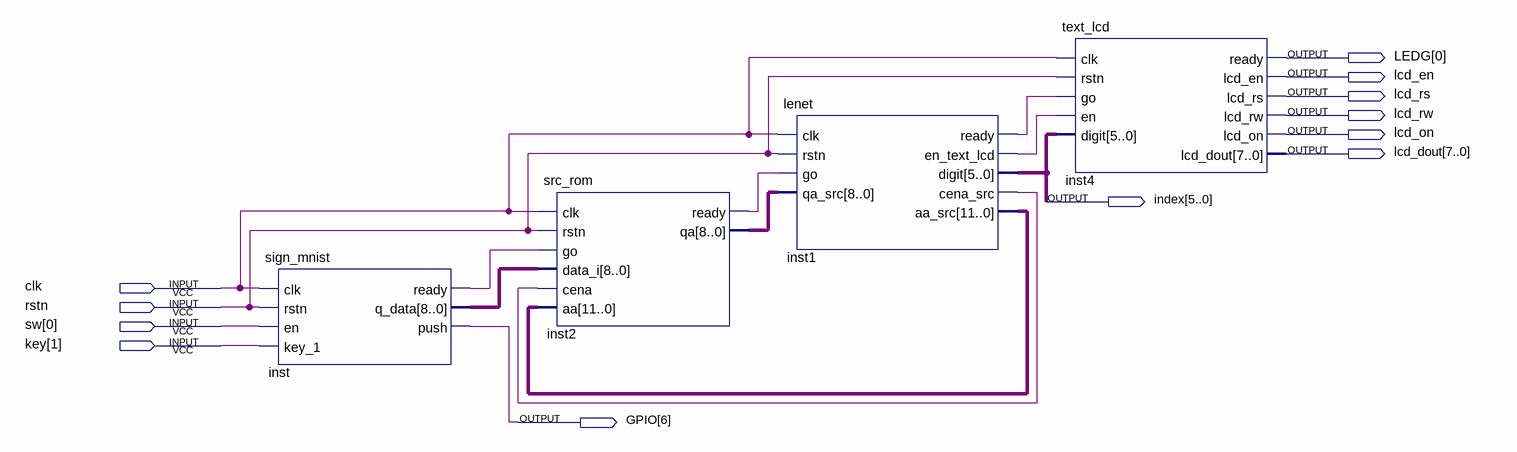
[diagram p0: schematic sheet]
// Quartus schematic sign_F_block.bdf as structural Verilog: 4 symbols, 12 pins
module sign_F_block (
  input  clk,
  input  rstn,
  input  [0:0] sw,
  input  [1:1] key,
  output [0:0] LEDG,
  output lcd_en,
  output lcd_rs,
  output lcd_rw,
  output lcd_on,
  output [7:0] lcd_dout,
  output [5:0] index,
  output [6:6] GPIO
);

  wire inst1_cena_src, inst1_en_text_lcd, inst1_ready, inst2_ready, inst_ready;
  wire [8:0] inst2_qa, inst_q_data;
  wire [11:0] inst1_aa_src;

  sign_mnist inst (
    .clk(clk), .rstn(rstn), .en(sw[0]), .key_1(key[1]), .ready(inst_ready), .q_data(inst_q_data),
    .push(GPIO[6]));
  src_rom inst2 (
    .clk(clk), .rstn(rstn), .go(inst_ready), .data_i(inst_q_data), .cena(inst1_cena_src), .aa(inst1_aa_src),
    .ready(inst2_ready), .qa(inst2_qa));
  lenet inst1 (
    .clk(clk), .rstn(rstn), .go(inst2_ready), .qa_src(inst2_qa), .ready(inst1_ready),
    .en_text_lcd(inst1_en_text_lcd), .digit(index), .cena_src(inst1_cena_src), .aa_src(inst1_aa_src));
  text_lcd inst4 (
    .clk(clk), .rstn(rstn), .go(inst1_ready), .en(inst1_en_text_lcd), .digit(index), .ready(LEDG[0]),
    .lcd_en(lcd_en), .lcd_rs(lcd_rs), .lcd_rw(lcd_rw), .lcd_on(lcd_on), .lcd_dout(lcd_dout));
endmodule
